# Altium schematic sheet USB MUX.SchDoc
size A; SheetNumber: 2; SheetTotal: 14
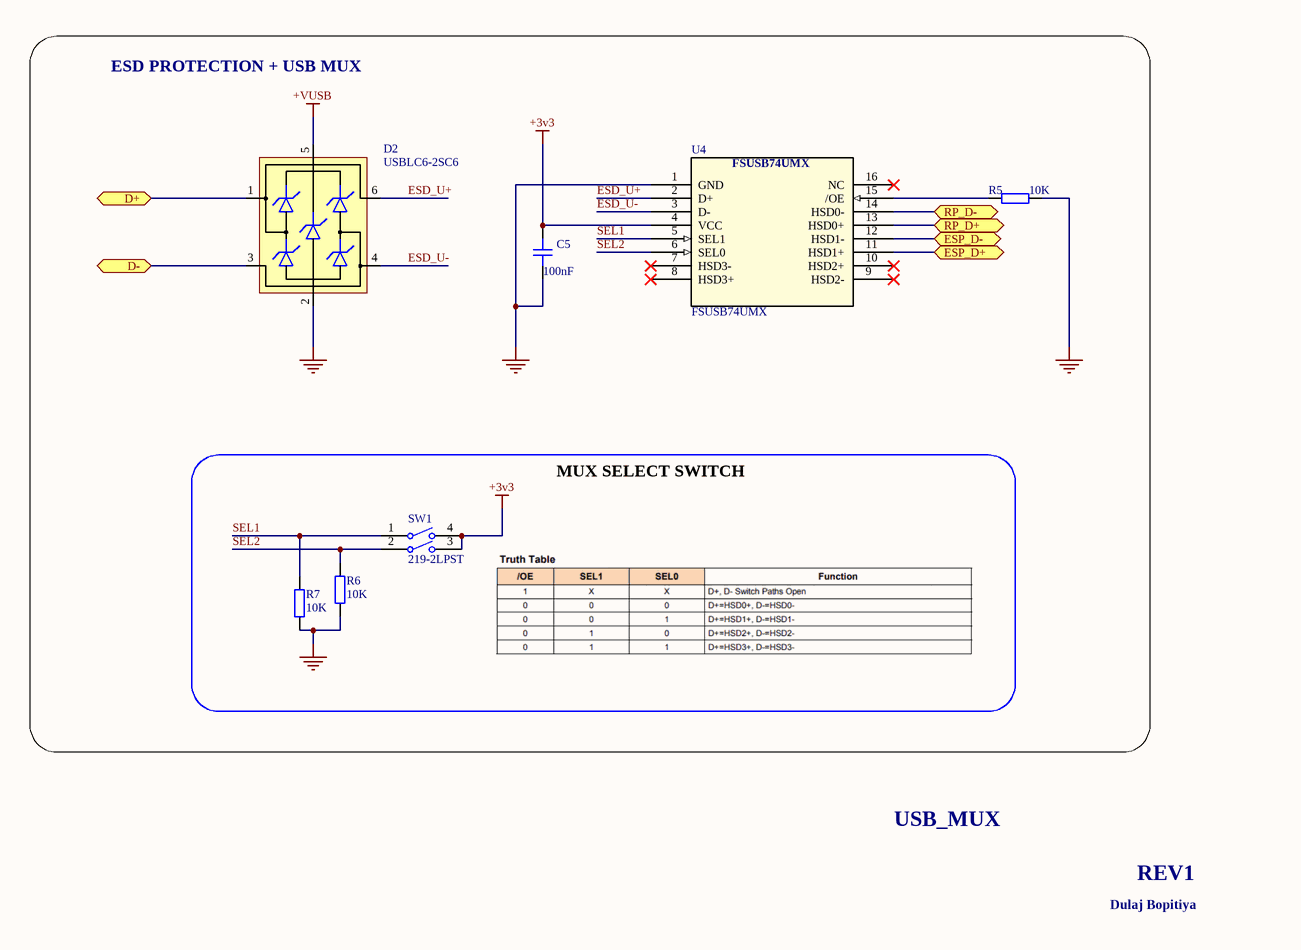
[diagram p0: USB MUX.SchDoc, left]

## Parts
C5  100nF  [CAP_0603]
D2  USBLC6-2SC6  [SOT-23-6]
R5  10K  [RES_0603]
R6  10K  [RES_0603]
R7  10K  [RES_0603]
SW1  219-2LPST  [CTS-219-2LPST_V]
U4  FSUSB74UMX  [UMLP16_1P8X2P6_ONS]

## Blocks framed on the sheet
ESD PROTECTION + USB MUX: C5 D2 R5 U4
MUX SELECT SWITCH: R6 R7 SW1

## Ports
D+ (bidir), D- (bidir), ESP_D+ (bidir), ESP_D- (bidir), RP_D+ (bidir), RP_D- (bidir)

## Nets
+3v3: C5.2 SW1.3 SW1.4 U4.4(VCC)
+VUSB: D2.5(VBUS)
GND: C5.1 D2.2(GND) R5.1 R6.1 R7.1 U4.1(GND)
D+: D2.1(IO1) ; port D+
D-: D2.3(IO2) ; port D-
ESD_U+: D2.6(IO1) U4.2(D+)
ESD_U-: D2.4(IO2) U4.3(D-)
ESP_D+: U4.11(HSD1+) ; port ESP_D+
ESP_D-: U4.12(HSD1-) ; port ESP_D-
RP_D+: U4.13(HSD0+) ; port RP_D+
RP_D-: U4.14(HSD0-) ; port RP_D-
SEL1: R7.2 SW1.1 U4.5(SEL1)
SEL2: R6.2 SW1.2 U4.6(SEL0)
NetR5_2: R5.2 U4.15(/OE)

Not connected (* = marked no-connect by the designer): U4 7(HSD3-)* 8(HSD3+)* 9(HSD2-)* 10(HSD2+)* 16(NC)*

## Notes on the sheet
- USB_MUX
- REV1
- Dulaj Bopitiya

## Library data of the parts
C5 = CAP_0603: Capacitor SMD 0603; Manufacturer: *; Manufacturer Part Number: *; Distributor Link: *; LCSC: *; Rating: *; Dielectric: *
D2 = USBLC6-2SC6: Low-Capacitance ESD Protection USB; Manufacturer: STMicroelectronics; Manufacturer Part Number: USBLC6-2SC6; Distributor Link: https://www.mouser.de/ProductDetail/STMicroelectronics/USBLC6-2SC6?qs=po45yt2pPpu%2FhNIlwQdTlg%3D%3D
R5-R7 = RES_0603: Resistor SMD 0603; Manufacturer: *; Manufacturer Part Number: *; Distributor Link: *; LCSC: *
SW1 = CMP-2000-05532-1: Surface Mount DIP Switch Auto Placeable, -55 to 85 degC, 4-Pin SMD, RoHS, Tube; Manufacturer: CTS Corporation; Sealed Option: Sealed; Circuitry: SPST; No of Positions: 2; Actuator Style: LowProfile; Type: Dip; Package Reference: 219-2LPST; Mounting Technology: SurfaceMount; Datasheet Version: 12/2008; Package Description: 4-Pin Surface Mount Device, Body 6.7 x 6.55 mm; Datasheet URL: http://www.ctscorp.com/wp-content/uploads/2016/01/219-Dec-30-2008.pdf; Termination Style: GullWing; Manufacturer URL: http://www.ctscorp.com/
U4 = FSUSB74UMX: No Description Available; Manufacturer_Name: onsemi; Copyright: Copyright (C) 2025 Ultra Librarian. All rights reserved.; Manufacturer_Part_Number: FSUSB74UMX; RefDes: RefDes; Type: Type